# Altium schematic sheet Driver.SchDoc: Driver
size A4; ApprovedBy: Nhatkhongbuon; Author: Nhatkhongbuon; Revision: 1.0; SheetNumber: 3; SheetTotal: 3; ProjectTitle: Mobile Robot
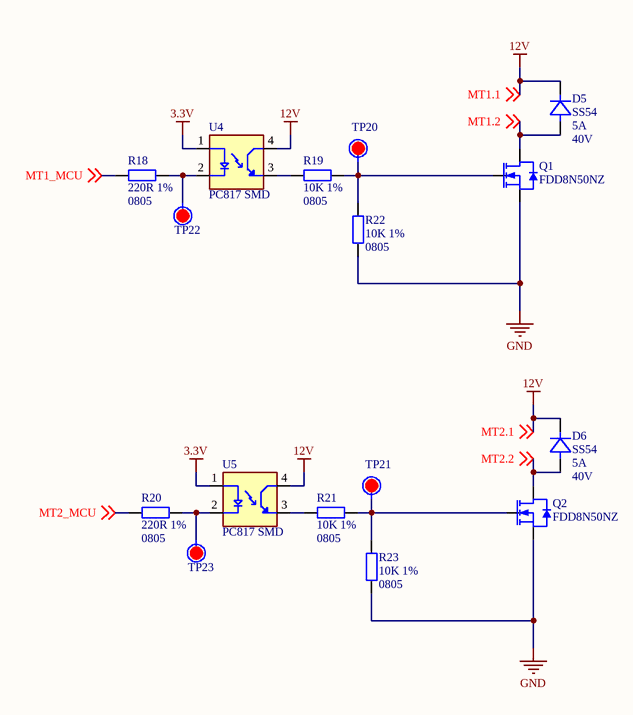
[diagram p0: Driver.SchDoc]

## Parts
D5  SS54  Current: 5A  DC Voltage: 40V  [SMA]
D6  SS54  Current: 5A  DC Voltage: 40V  [SMA]
Q1  FDD8N50NZ  [TO252-2]
Q2  FDD8N50NZ  [TO252-2]
R18  220R 1%  Size: 0805  [RES_SMD_0805]
R19  10K 1%  Size: 0805  [RES_SMD_0805]
R20  220R 1%  Size: 0805  [RES_SMD_0805]
R21  10K 1%  Size: 0805  [RES_SMD_0805]
R22  10K 1%  Size: 0805  [RES_SMD_0805]
R23  10K 1%  Size: 0805  [RES_SMD_0805]
TP20  Test Point  [TEST_POINT]  (value not drawn)
TP21  Test Point  [TEST_POINT]  (value not drawn)
TP22  Test Point  [TEST_POINT]  (value not drawn)
TP23  Test Point  [TEST_POINT]  (value not drawn)
U4  PC817 SMD  [PC817XL_SMD]
U5  PC817 SMD  [PC817XL_SMD]

## Nets
3.3V: U4.1(A) U5.1(A)
12V: D5.C D6.C U4.4(CT) U5.4(CT) ; off-sheet MT1.1, off-sheet MT2.1  [also labelled MT1.1, MT2.1]
GND: Q1.3(S) Q2.3(S) R22.1 R23.1
MT1.2: D5.A Q1.2(D) ; off-sheet MT1.2
MT1_MCU: R18.2 ; off-sheet MT1_MCU
MT2.2: D6.A Q2.2(D) ; off-sheet MT2.2
MT2_MCU: R20.2 ; off-sheet MT2_MCU
NetQ1_1: Q1.1(G) R19.2 R22.2 TP20.1
NetQ2_1: Q2.1(G) R21.2 R23.2 TP21.1
NetR18_1: R18.1 TP22.1 U4.2(C)
NetR19_1: R19.1 U4.3(ET)
NetR20_1: R20.1 TP23.1 U5.2(C)
NetR21_1: R21.1 U5.3(ET)

## Notes on the sheet
- Author:
- Title:
- Size:
- A4
- Project:
- Approved:
- Revision:
- Modified Date:
- CONFIDENTIAL
- Date:
- SW Version:

## Library data of the parts
D5 D6 = SS54: DIODE SCHOTTKY 40V 5A SMA; Manufacturer: EVVO; Manufacture Part Number: SS54; Packaging: Cut Tape (CT); Link: https://www.digikey.cn/en/products/detail/evvo/SS54/21407219; Price: $0.73
Q1 Q2 = FDD8N50NZ: 650V 7A 1 N-Channel TO-252 MOSFETs ROHS; Manufacturer: VBsemi Elec; Manufacture Part Number: FDD8N50NZTM-VB; Packaging: Tube; Link: https://www.lcsc.com/product-detail/MOSFETs_VBsemi-Elec-FDD8N50NZTM-VB_C7525025.html; Price: $ 0.57; Drain to Source Voltage (Vdss): 650V; Current - Continuous Drain (Id) @ 25°C: 7A; FET Type: N-Channel
R18 R20 = R0805_220R: 220 Ohms ±1% 0.125W, 1/8W Chip Resistor 0805 (2012 Metric) Automotive AEC-Q200, Moisture Resistant Thick Film; Manufacturer: TE Connectivity Passive Product; Manufacture Part Number: CRGCQ0805F220R; Packaging: Cut Tape (CT); Link: https://www.digikey.cn/en/products/detail/te-connectivity-passive-product/CRGCQ0805F220R/8576343; Price: $0.10
R19 R21-R23 = R0805_10K: 10 kOhms ±1% 0.125W, 1/8W Chip Resistor 0805 (2012 Metric) Moisture Resistant Thick Film; Manufacturer: YAGEO; Manufacture Part Number: RC0805FR-0710KL; Packaging: Cut Tape (CT); Price: $0.10; Link: https://www.digikey.cn/en/products/detail/yageo/RC0805FR-0710KL/727535
TP20-TP23 = TEST_POINT
U4 U5 = PC817_SMD: Optoisolator Transistor Output 5000Vrms 1 Channel 4-SMD; Manufacturer: American Bright Optoelectronics Corporation; Manufacture Part Number: APC-817C1-SL; Packaging: Cut Tape (CT); Link: https://www.digikey.cn/en/products/detail/american-bright-optoelectronics-corporation/APC-817C1-SL/16273175; Price: $0.43